# Altium schematic sheet i2c-mux.SchDoc
size A4
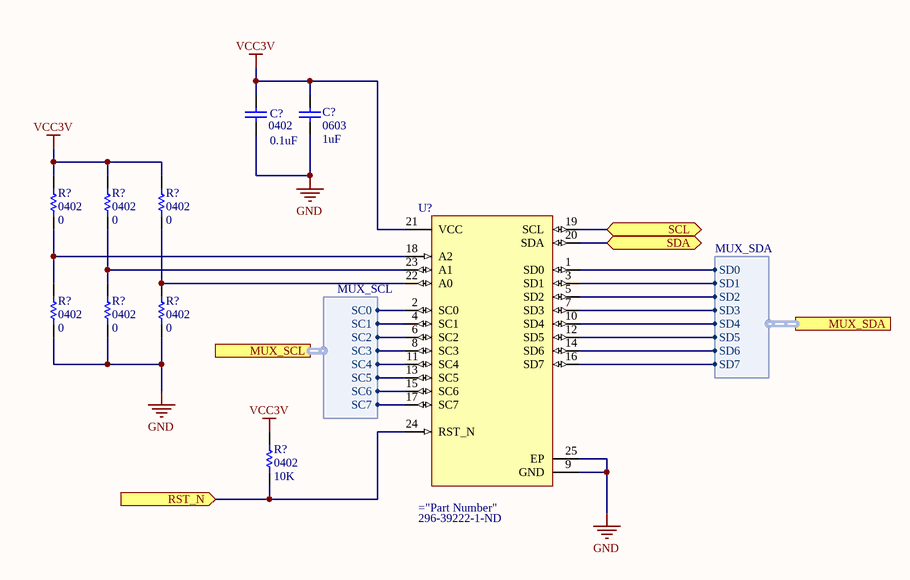
[diagram p0: i2c-mux.SchDoc]

## Parts
(Parts that share a designator on the sheet are numbered #1, #2 ... from top to bottom, then left to right.)
C?#1  0402  value 0.1uF  [1608[0603]]
C?#2  0603  value 1uF  [RAD-0.3]
R?#1  0402  value 0  [AXIAL-0.3]
R?#2  0402  value 0  [AXIAL-0.3]
R?#3  0402  value 0  [AXIAL-0.3]
R?#4  0402  value 0  [AXIAL-0.3]
R?#5  0402  value 0  [AXIAL-0.3]
R?#6  0402  value 0  [AXIAL-0.3]
R?#7  0402  value 10K  [AXIAL-0.3]
U?  Supplier Part Number 1: 296-39222-1-ND  [RGE0024C]  (hidden comment: TCA9548ARGER)

## Ports
MUX_SCL (harness MUX_SCL), MUX_SDA (harness MUX_SDA), RST_N (in), SCL (bidir), SDA (bidir)

## Harnesses
MUX_SCL: SC0, SC1, SC2, SC3, SC4, SC5, SC6, SC7
MUX_SDA: SD0, SD1, SD2, SD3, SD4, SD5, SD6, SD7

## Nets
GND: C?#1.1 C?#2.1 R?#4.1 R?#5.1 R?#6.1 U?.9(GND) U?.25(EP)
VCC3V: C?#1.2 C?#2.2 R?#1.2 R?#2.2 R?#3.2 R?#7.2 U?.21(VCC)
RST_N: R?#7.1 U?.24(RST_N) ; port RST_N
SCL: U?.19(SCL) ; port SCL
SDA: U?.20(SDA) ; port SDA
NetR?#1_1: R?#1.1 R?#4.2 U?.18(A2)
NetR?#2_1: R?#2.1 R?#5.2 U?.23(A1)
NetR?#3_1: R?#3.1 R?#6.2 U?.22(A0)
NetU?_1: U?.1(SD0) ; port MUX_SDA.SD0
NetU?_2: U?.2(SC0) ; port MUX_SCL.SC0
NetU?_3: U?.3(SD1) ; port MUX_SDA.SD1
NetU?_4: U?.4(SC1) ; port MUX_SCL.SC1
NetU?_5: U?.5(SD2) ; port MUX_SDA.SD2
NetU?_6: U?.6(SC2) ; port MUX_SCL.SC2
NetU?_7: U?.7(SD3) ; port MUX_SDA.SD3
NetU?_8: U?.8(SC3) ; port MUX_SCL.SC3
NetU?_10: U?.10(SD4) ; port MUX_SDA.SD4
NetU?_11: U?.11(SC4) ; port MUX_SCL.SC4
NetU?_12: U?.12(SD5) ; port MUX_SDA.SD5
NetU?_13: U?.13(SC5) ; port MUX_SCL.SC5
NetU?_14: U?.14(SD6) ; port MUX_SDA.SD6
NetU?_15: U?.15(SC6) ; port MUX_SCL.SC6
NetU?_16: U?.16(SD7) ; port MUX_SDA.SD7
NetU?_17: U?.17(SC7) ; port MUX_SCL.SC7

## Library data of the parts
C?#1 = Cap Semi: Capacitor (Semiconductor SIM Model); Published: 8-Jun-2000; LatestRevisionDate: 29-May-2009; LatestRevisionNote: IPC-7351 Footprint Added.; PackageReference: C1206; Publisher: Altium Limited; PackageDescription: Chip Capacitor; Supplier: Digi-Key; Supplier Part Number: 587-3807-1-ND
C?#2 = Cap: Capacitor; Published: 8-Jun-2000; LatestRevisionDate: 17-Jul-2002; LatestRevisionNote: Re-released for DXP Platform.; PackageReference: RAD-0.3; Publisher: Altium Limited; PackageDescription: Radial Cap, Thru-Hole; 2 Leads; 0.3 in Pin Spacing
R?#1-R?#7 = Res1: Resistor; Published: 8-Jun-2000; LatestRevisionDate: 17-Jul-2002; LatestRevisionNote: Re-released for DXP Platform.; PackageReference: AXIAL-0.3; Publisher: Altium Limited; PackageDescription: Axial Device, Thru-Hole; 2 Leads; 0.3 in Pin Spacing
U? = TCA9548ARGER: Supplier 1: Digi-Key